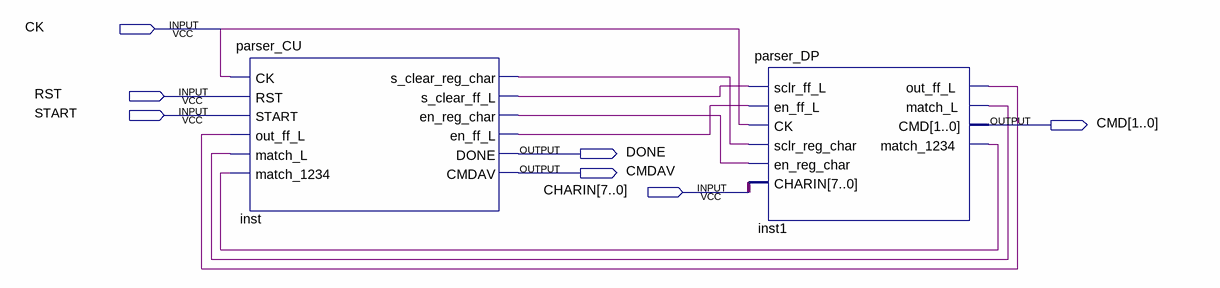
[diagram p0: schematic sheet]
// Quartus schematic parser.bdf as structural Verilog: 2 symbols, 7 pins
module parser (
  input  CK,
  input  RST,
  input  START,
  input  [7:0] CHARIN,
  output [1:0] CMD,
  output DONE,
  output CMDAV
);

  wire inst1_match_1234, inst1_match_l, inst1_out_ff_l, inst_en_ff_l, inst_en_reg_char, inst_s_clear_ff_l,
       inst_s_clear_reg_char;

  parser_CU inst (
    .CK(CK), .RST(RST), .START(START), .out_ff_L(inst1_out_ff_l), .match_L(inst1_match_l),
    .match_1234(inst1_match_1234), .s_clear_reg_char(inst_s_clear_reg_char),
    .s_clear_ff_L(inst_s_clear_ff_l), .en_reg_char(inst_en_reg_char), .en_ff_L(inst_en_ff_l), .DONE(DONE),
    .CMDAV(CMDAV));
  parser_DP inst1 (
    .sclr_ff_L(inst_s_clear_ff_l), .en_ff_L(inst_en_ff_l), .CK(CK), .sclr_reg_char(inst_s_clear_reg_char),
    .en_reg_char(inst_en_reg_char), .CHARIN(CHARIN), .out_ff_L(inst1_out_ff_l), .match_L(inst1_match_l),
    .CMD(CMD), .match_1234(inst1_match_1234));
endmodule
